# Altium schematic sheet DS3231.SchDoc
size A; SheetNumber: 2; SheetTotal: 2
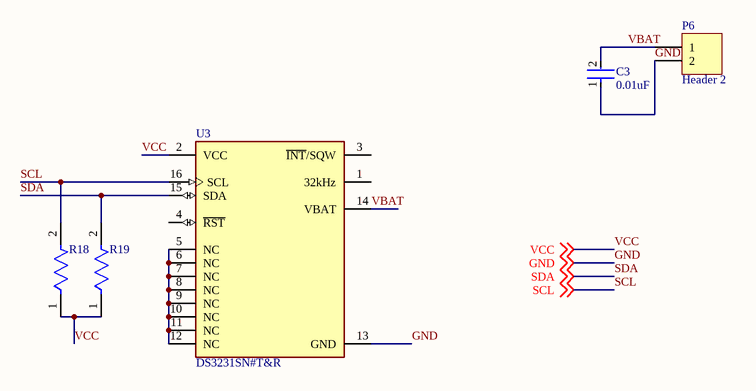
[diagram p0: DS3231.SchDoc]

## Parts
C3  0.01uF  [FP-C1206C-EB-MFG]
P6  Header 2  [HDR1X2]
R18  (no value)  [FP-CR1206-IPC_B]
R19  (no value)  [FP-CR1206-IPC_B]
U3  DS3231SN#T&R  [FP-W16-H2-MFG]

## Nets
GND: C3.1 P6.2 U3.13(GND) ; off-sheet GND
SCL: R18.2 U3.16(SCL) ; off-sheet SCL
SDA: R19.2 U3.15(SDA) ; off-sheet SDA
VBAT: C3.2 P6.1 U3.14(VBAT)
VCC: R18.1 R19.1 U3.2(VCC) ; off-sheet VCC
NetU3_5: U3.5(NC) U3.6(NC) U3.7(NC) U3.8(NC) U3.9(NC) U3.10(NC) U3.11(NC) U3.12(NC)

Not connected (* = marked no-connect by the designer): U3 1(32kHz) 3(~{INT}/SQW) 4(~{RST})

## Library data of the parts
C3 = CMP-03020-001426-1: 1206 C 330nF Ceramic Multilayer Capacitor; 25 VDC; +125degC; X7R Dielec; +/-10%; Manufacturer: KEMET; Manufacturer Part Number: C1206C334K3RACTU; Capacitance: 0.33 μF; Value: 0.33 μF; Voltage Rating: 25 V; Tolerance: 0.1; Automotive Grade: Grade 0; Temperature Coefficient: 15%; Digikey Description: 1206 C 330nF Ceramic Multilayer Capacitor; 25 VDC; +125degC; X7R Dielec; +/-10%; Package: C1206C-EB; Temperature: -55°C to +150°C; Category: Cap; Device Class L1: Passive Components; Lead Free: Yes; ComponentLink2Description: Datasheet; Material: Ceramic; Automotive: Yes; Temperature Range Low: -55°C; Height: 0.88mm; Octopart: https://octopart.com/c1206c334k3ractu-kemet-133095; Mouser Description: Multilayer Ceramic Capacitors MLCC - SMD/SMT 25volts 0.33uF X7R 10%; ComponentLink2URL: https://content.kemet.com/datasheets/KEM_C1007_X8R_ULTRA_150C_SMD.pdf; Temperature Range High: +150°C; Ipc Land Pattern Name: CAPC320160X78; RoHS: TRUE; Temperature Characteristic: X7R; Device Class L2: Capacitors; Device Class L3: Ceramic Capacitors
P6 = Header 2: Header, 2-Pin; LatestRevisionDate: 17-Jul-2002; LatestRevisionNote: Re-released for DXP Platform.; Publisher: Altium Limited
R18 R19 = CMP-07231-005593-1: Thick Film Chip Resistors 1206 10kΩ 0.25W 5% 200ppm/°C; Voltage Rating: 200V; Resistance: 10kR; Max Power Dissipation: 250mW; Temperature Coefficient: 200ppm/°C; Height: 0.6mm; Case Code (Imperial): 1206; REACH SVHC: No SVHC; Depth: 1.6mm; Mount: Surface Mount; Termination: SMD/SMT; Case/Package: 1206; Min Operating Temperature: -55°C; Features: Moisture Resistant; Number of Pins: 2; Length: 3.2mm; Military Standard: Not; Radiation Hardening: No; Max Operating Temperature: 155°C; Power Rating: 250mW; Case Code (Metric): 3216; Package Quantity: 1; Composition: Thick Film; Tolerance: 5%; Voltage Rating (DC): 200V; Contact Plating: Tin; Thickness: 610um; Number of Terminations: 2; Packaging: Tape and Reel; Width: 1.6mm
U3 = CMP-0254-00375-2: IC RTC CLK/CALENDAR I2C 16-SOIC; Operating Supply Voltage: 3.3V; Max Supply Voltage: 5.5V; Logic Function: Clock; Time Format: HH:MM:SS; Date Format: YY-MM-DD-dd; Min Supply Voltage: 2.3V; Min Operating Temperature: -40°C; Packaging: Tape and Reel; Radiation Hardening: No; Package Quantity: 1000; Case/Package: SOIC; Max Operating Temperature: 85°C; Lead Free: Lead Free; Interface: I2C; Contact Plating: Tin; Number of Pins: 16; Mount: Surface Mount